# EAGLE design Boje (EAGLE 7.4.0)
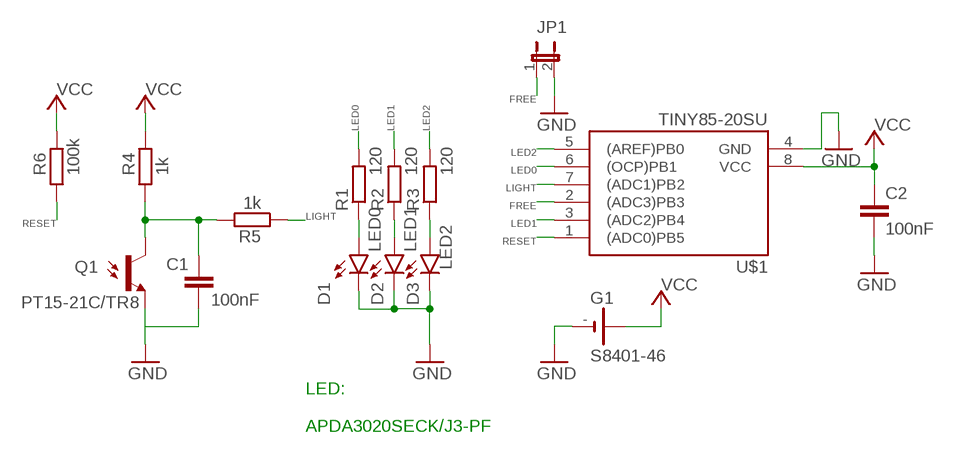
[diagram p0: schematic, sheet 1]

## Parts
C1  100nF  C-EUC0603  [C0603]
C2  100nF  C-EUC0603  [C0603]
D1  LED0  LED5MM  [LED5MM]
D2  LED1  LED5MM  [LED5MM]
D3  LED2  LED5MM  [LED5MM]
G1  S8401-46  CR2032V  [CR2032V]
JP1  JP1E  [JP1]
Q1  PT15-21C/TR8  PHOTOTRANSISTORPT17-21C-L41-TR8  [PT17-21C-L41-TR8]
R1  120  R-EU_R0603  [R0603]
R2  120  R-EU_R0603  [R0603]
R3  120  R-EU_R0603  [R0603]
R4  1k  R-EU_R0603  [R0603]
R5  1k  R-EU_R0603  [R0603]
R6  100k  R-EU_R0603  [R0603]
U$1  TINY85-20SU  TINY25/45/85-20SU  [SOIC8]

## Nets
FREE: JP1.1 U$1.2((ADC3)PB3)
GND: C1.1 C2.2 D1.K(C) D2.K(C) D3.K(C) G1.- JP1.2 Q1.E U$1.4(GND)
LED0: R1.2 U$1.6((OCP)PB1)
LED1: R2.2 U$1.3((ADC2)PB4)
LED2: R3.2 U$1.5((AREF)PB0)
LIGHT: R5.1 U$1.7((ADC1)PB2)
N$1: C1.2 Q1.C R4.1 R5.2
N$4: D1.A R1.1
N$5: D2.A R2.1
N$6: D3.A R3.1
RESET: R6.1 U$1.1((ADC0)PB5)
VCC: C2.1 G1.+0(+) G1.+1(+) R4.2 R6.2 U$1.8(VCC)

## Notes on the sheet
- LED:
  
  APDA3020SECK/J3-PF

## Library data of the parts
C1 C2 = rcl:C-EU: CAPACITOR, European symbol
D1-D3 = SparkFun-LED:LED: LEDs Standard schematic elements and footprints for 5mm, 3mm, 1206, and 0603 sized LEDs. 5mm - Spark Fun Electronics SKU : COM-00529 (and others)
G1 = battery_holder:CR2032V: LI BATTERY Varta
JP1 = jumper:JP1E: JUMPER
Q1 = SparkFun-DiscreteSemi:PHOTOTRANSISTOR; PROD_ID: TRANS-12141
R1-R6 = rcl:R-EU_: RESISTOR, European symbol
U$1 = avr-6:TINY25/45/85

## Net classes
0 default: clearance 0.205 mm

## Board
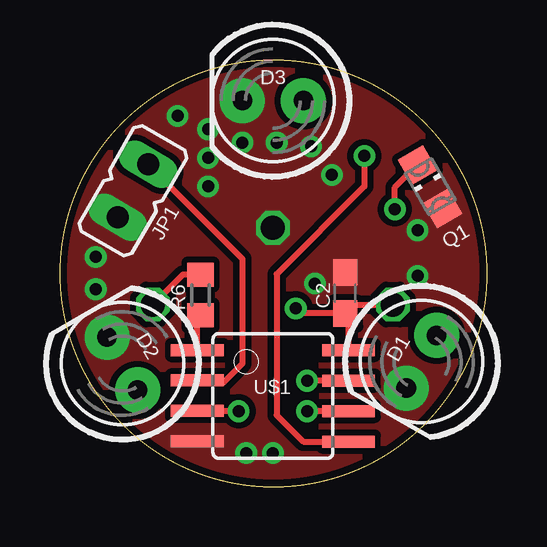
[diagram p1: board, top side]
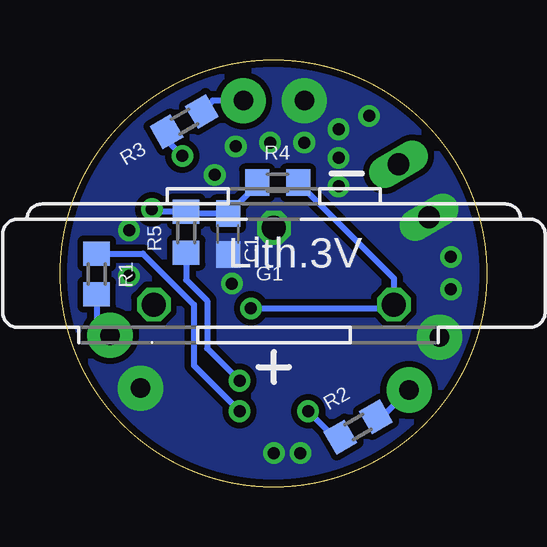
[diagram p2: board, bottom side, seen from below]

Size 17.78 x 17.78 mm. Coordinates in mm from the lower left corner, seen from the top.
Outline: circle at 8.89,8.89 radius 8.89
Copper layers (1*16): Top 0.035mm / dielectric 1.5mm / Bottom 0.035mm
Design rules "PCB-POOL Standard *": minimum track width 10mil, minimum drill 0.3mm, track to track 0.15mm, track to pad 0.15mm, pad to pad 0.15mm, via to via 0.15mm, smd to smd 0.15mm, copper to edge 0.3mm, drill to drill 0.2mm, minimum pad ring 0.2mm, minimum via ring 0.15mm, stop-mask expansion 0.075mm, vias tented up to drill 0mil, thermal gap 0.2mm

### Footprints (pad centres in the part's own frame; a part is rotated, then mirrored left to right if it is on the bottom)
C0603 = smd 1.1 x 1: 1 -0.85,0; 2 0.85,0
LED5MM = drill 0.813 pad 1.88: A -1.27,0; K 1.27,0
CR2032V = drill 1 octagon: +0 -1.27,-5; +1 -1.27,5; - 1.93,0
JP1 = drill 0.914 long: 1 0,-1.27; 2 0,1.27
PT17-21C-L41-TR8 = smd 1.2 x 1.2: C 0,1.05; E 0,-1.05
R0603 = smd 1 x 1.1: 1 -0.85,0; 2 0.85,0
SOIC8 = smd 0.5 x 2.2: 1 -1.905,-3.154; 2 -0.645,-3.154; 3 0.625,-3.154; 4 1.895,-3.154; 5 1.905,3.154; 6 0.635,3.154; 7 -0.635,3.154; 8 -1.905,3.154

### Placement (x,y rotation side)
C1  10.78,10.53 90 bottom
C2  11.89,8.07 90 top
D1  15.06,5.21 240 top
D2  2.6,5.13 120 top
D3  8.87,16.08 180 top
G1  8.87,8.86 90 bottom
JP1  3.04,12.33 150 top
Q1  15.42,12.5 30 top
R1  16.25,8.86 90 bottom
R2  5.36,2.49 210 bottom
R3  12.6,15.21 210 bottom
R4  8.71,12.67 0 bottom
R5  12.52,10.61 90 bottom
R6  5.85,7.99 90 top
U$1  8.87,3.78 270 top

### Tracks (layer width: path | path; a pad name or v marks a point on that pad's centre or on a via)
FREE
  Top 0.254: JP1.1 7.6,9.5 7.6,5.13 6.81,4.34 5.81,4.34 U$1.2
GND  (via drill 0.5)
  other vias: 1.49,9.58 6.17,12.51 11.33,12.99 7.76,1.4 8.87,1.4 1.49,8.23 10.62,8.46 14.9,10.69 6.17,13.7 6.17,14.89 4.9,15.45 7.6,14.34 9.03,14.34 10.46,14.18 14.9,8.78
  pour Top (isolate 0.254, no thermals): -0.18,-0.11 17.92,-0.11 17.92,17.99 -0.18,17.99
  pour Bottom (isolate 0.254, no thermals): -0.18,17.99 17.92,17.99 17.92,-0.11 -0.18,-0.11
LED0  (via drill 0.5)
  Top 0.254: U$1.6 v10.3,3.15
  Bottom 0.254: R1.2 14.32,9.71 12.2,7.59 12.2,5.05 v10.3,3.15
LED1  (via drill 0.5)
  Top 0.254: U$1.3 v7.43,3.16 v7.44,3.15
  Bottom 0.254: R2.2 6.36,2.06 v7.44,3.15
LED2  (via drill 0.5)
  Top 0.254: U$1.5 10.14,1.88 9.03,2.99 9.03,8.86 12.68,12.51 v12.68,13.78
  Bottom 0.254: R3.2 13.34,14.44 v12.68,13.78
LIGHT  (via drill 0.5)
  Top 0.254: U$1.7 v10.3,4.42
  Bottom 0.254: R5.1 12.52,8.62 11.65,7.75 11.65,5.77 v10.3,4.42
N$1  (via drill 0.5)
  Top 0.254: v13.95,11.56 13.95,12.47 Q1.C
  Bottom 0.254: v13.95,11.56 13.85,11.46 R5.2 12.44,11.38 C1.2 9.56,12.59 R4.1
N$4
  Bottom 0.254: R1.1 16.25,6.87 D1.A
N$5
  Bottom 0.254: R2.1 4.35,2.91 D2.A
N$6
  Bottom 0.254: D3.A 11.42,16.08 R3.1
RESET
  Top 0.254: U$1.1 5.72,7 R6.1
VCC  (via drill 0.5)
  Top 0.254: U$1.8 12.02,7.08 C2.1 | R6.2 5.12,8.84 G1.+0 | C2.1 12.26,7.59 G1.+1 | C2.1 10.04,7.22 v9.82,7.43
  Bottom 0.254: R4.2 3.87,8.68 G1.+0 4.03,7.43 v9.82,7.43

### Text on the board
_tNames: D3 | LDR1 | J2 | D2 | R2 | R3 | R1 | D1 | IC1
_bNames: J3 | J1